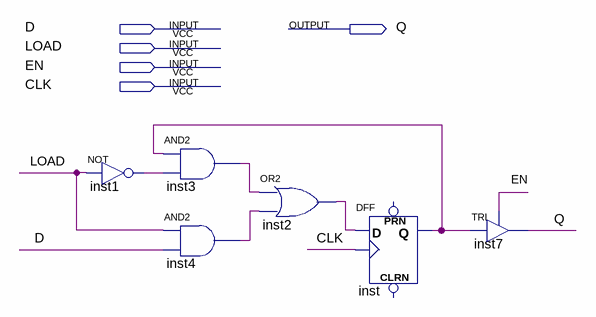
[diagram p0: schematic sheet]
// Quartus schematic LoadDFF.bdf as structural Verilog: 6 symbols, 5 pins
module LoadDFF (
  input  D,
  input  LOAD,
  input  EN,
  input  CLK,
  output Q
);

  wire inst1_out, inst2_out, inst3_out, inst4_out, inst_q;

  not inst1 (inst1_out, LOAD);
  and inst3 (inst3_out, inst_q, inst1_out);
  and inst4 (inst4_out, LOAD, D);
  or inst2 (inst2_out, inst3_out, inst4_out);
  DFF inst (.CLK(CLK), .D(inst2_out), .Q(inst_q));  // open: CLRN, PRN
  TRI inst7 (.IN(inst_q), .OE(EN), .OUT(Q));
endmodule
